# EasyEDA Pro project TRV-Controller.epro, schematic PoESupply_WithPSU

## Sheets
1 PoE isolator: Board Name: TRV-Controller; Create Date: 2024-07-17; Page Name: PoE isolator; Project Name: TRV-Controller; Schematic Name: PoESupply_WithPSU; Update Date: 2025-01-25; Add into BOM: yes; Company: DemoEffect; Convert to PCB: yes; Date: 2024-01-25; Draw By: Peter; REV: 1.1; Sheet: 1/1
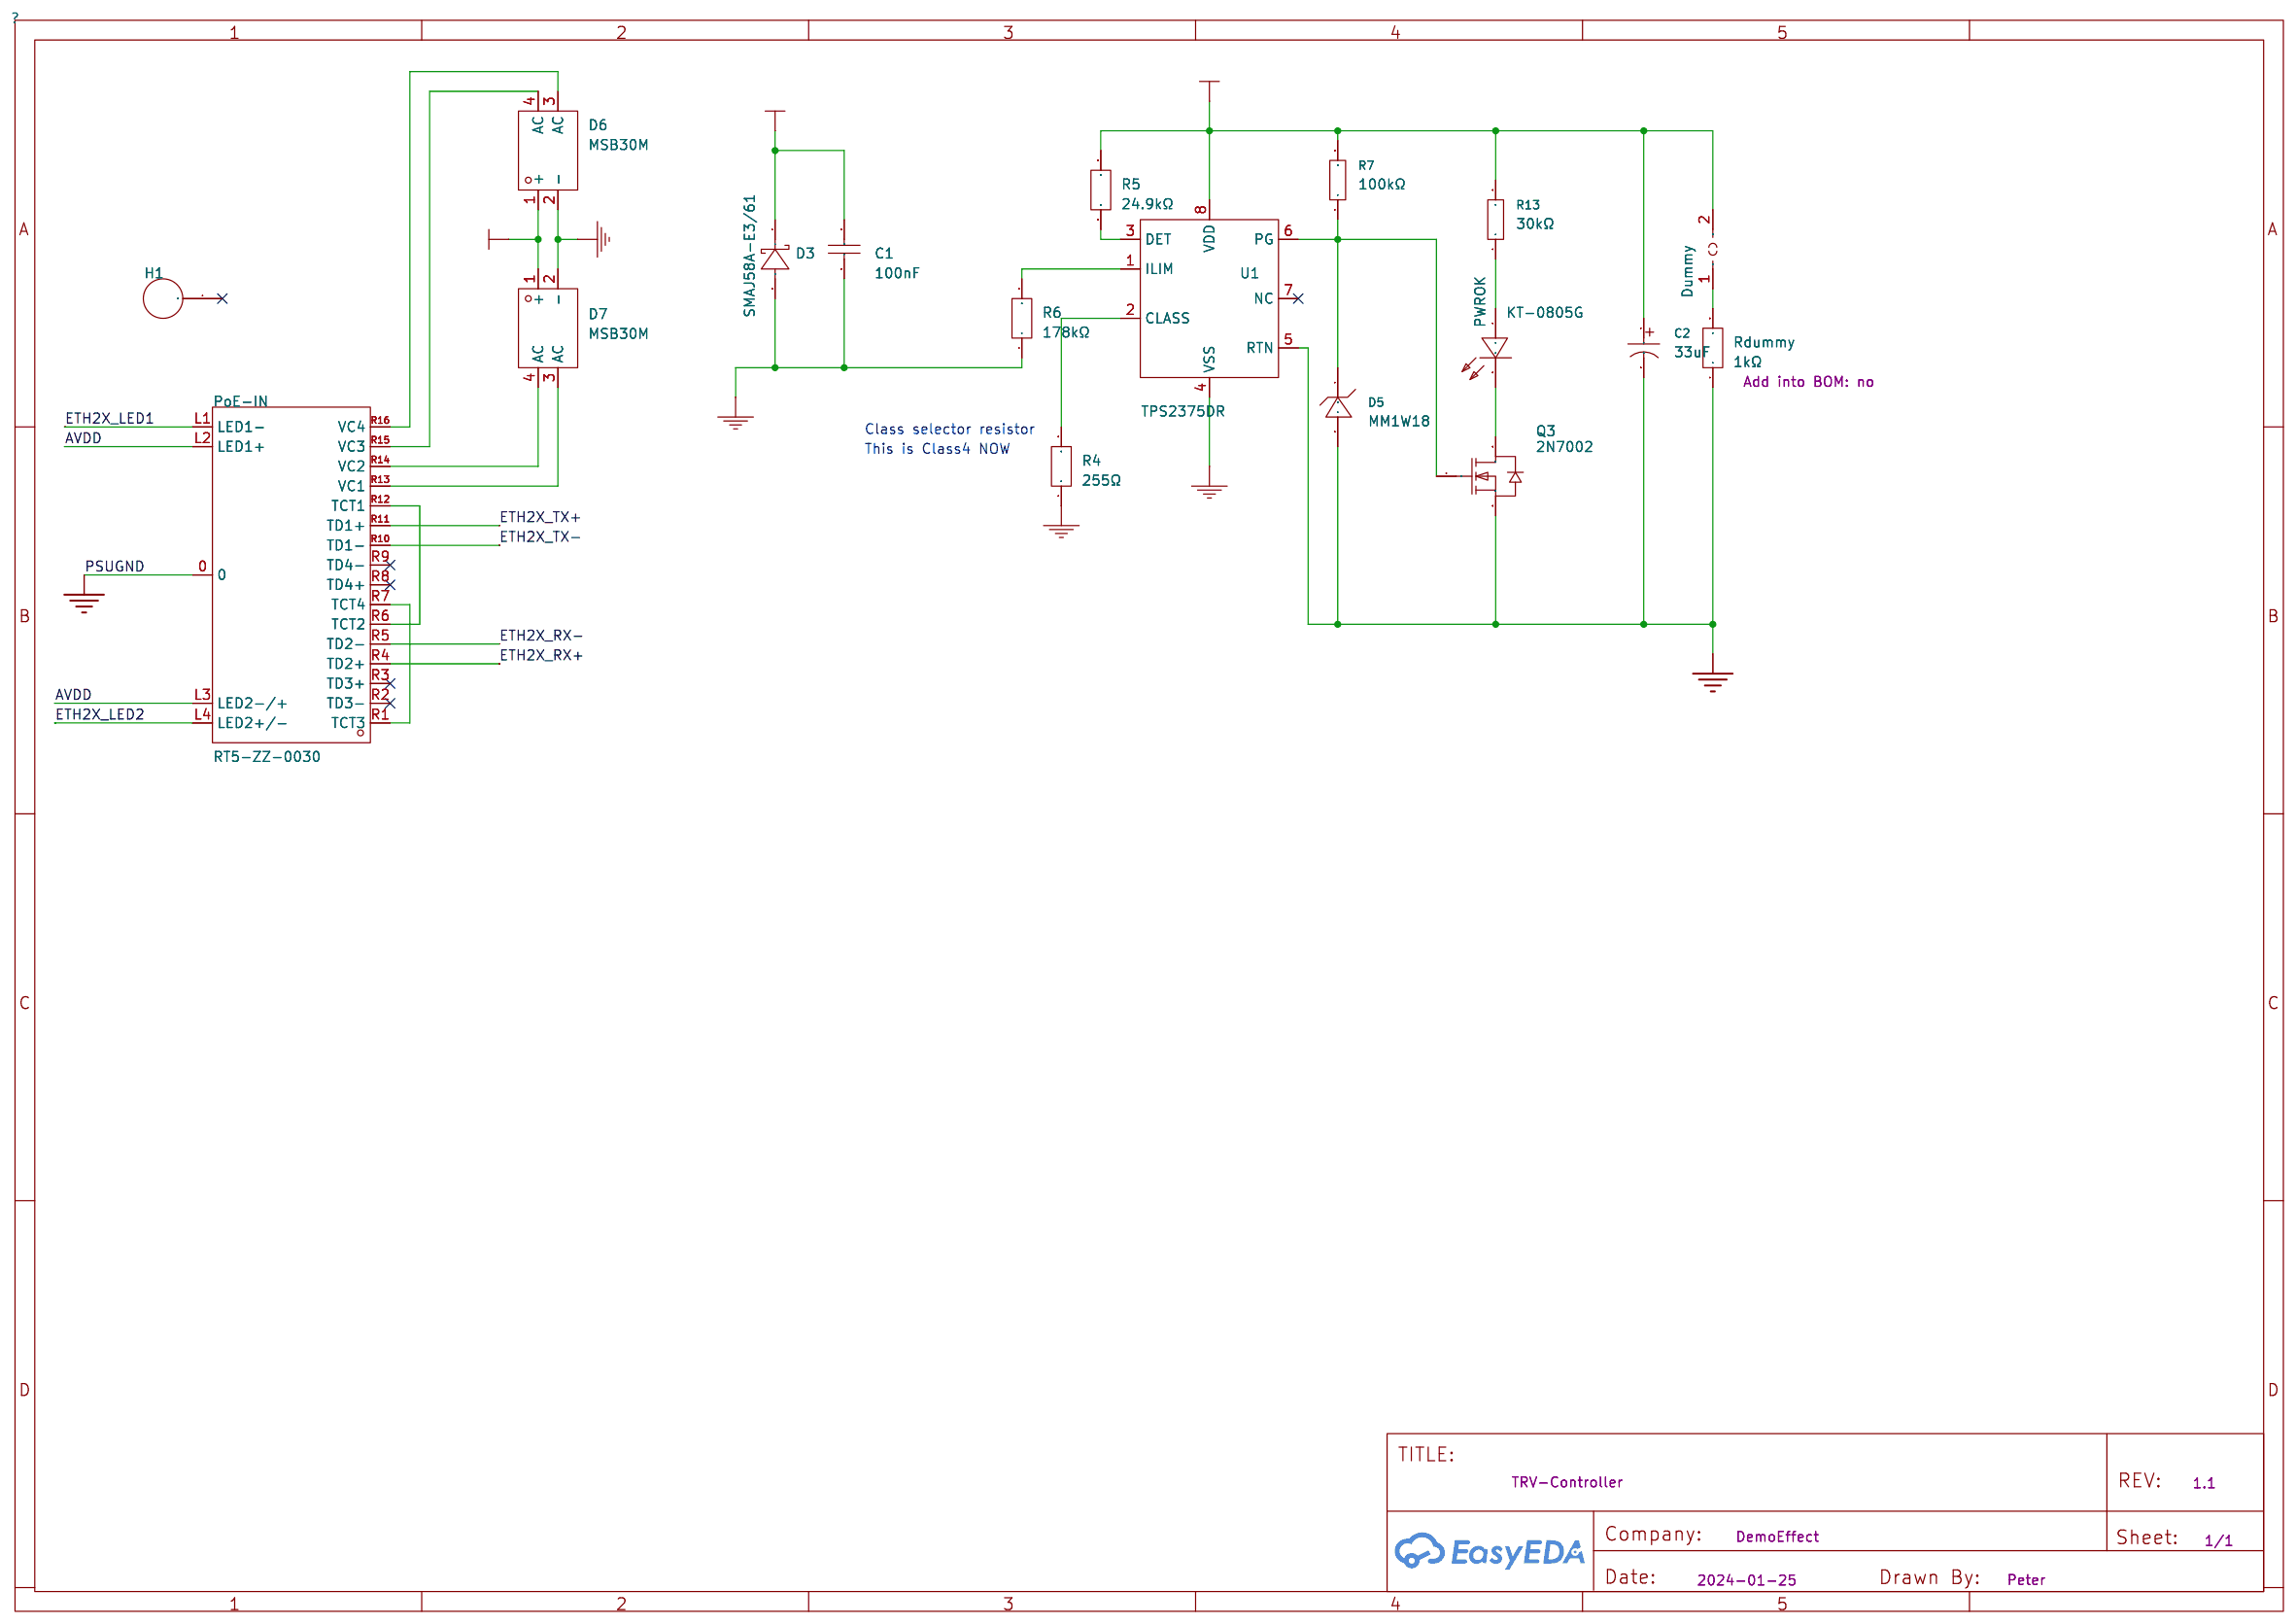
[diagram p0: PoE isolator]
2 Power supplies: Page Name: Power supplies; Update Date: 2024-08-13; Drawn: EasyEDA; Page Size: A4; Version: V1.1
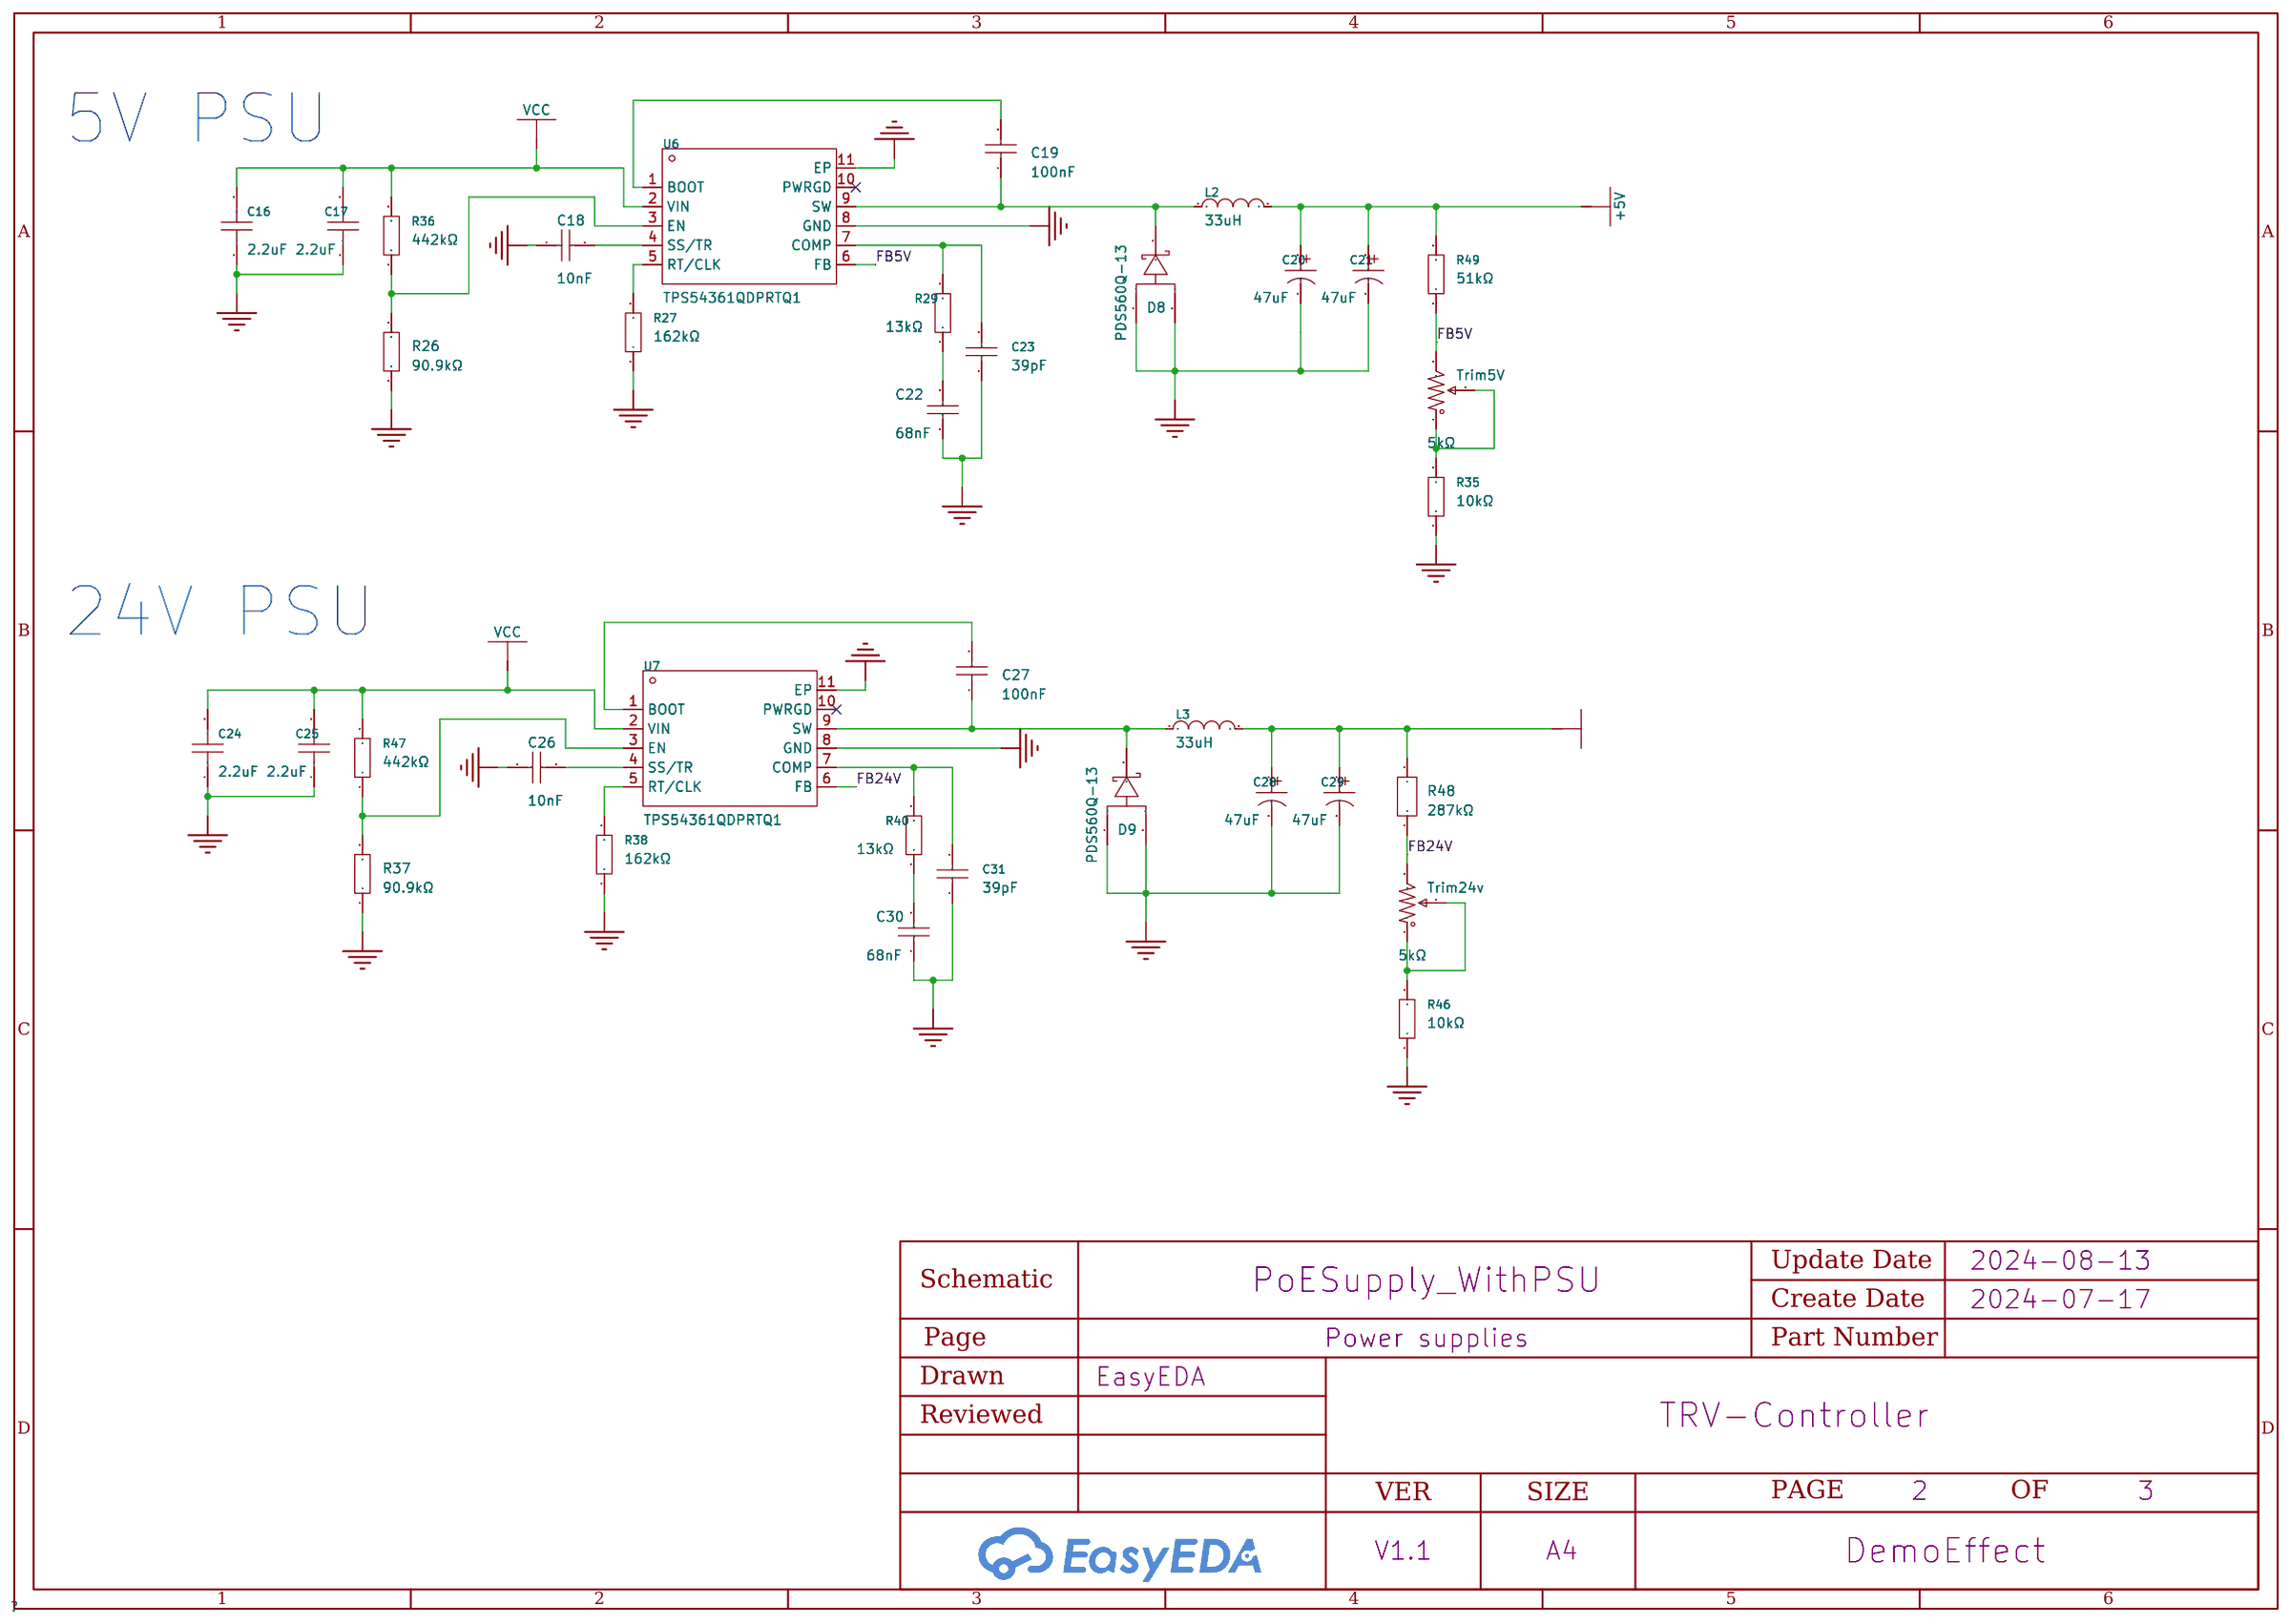
[diagram p1: Power supplies]
3 MCU: Page Name: MCU; Drawn: Peter; Page Size: A4; Version: V1.1
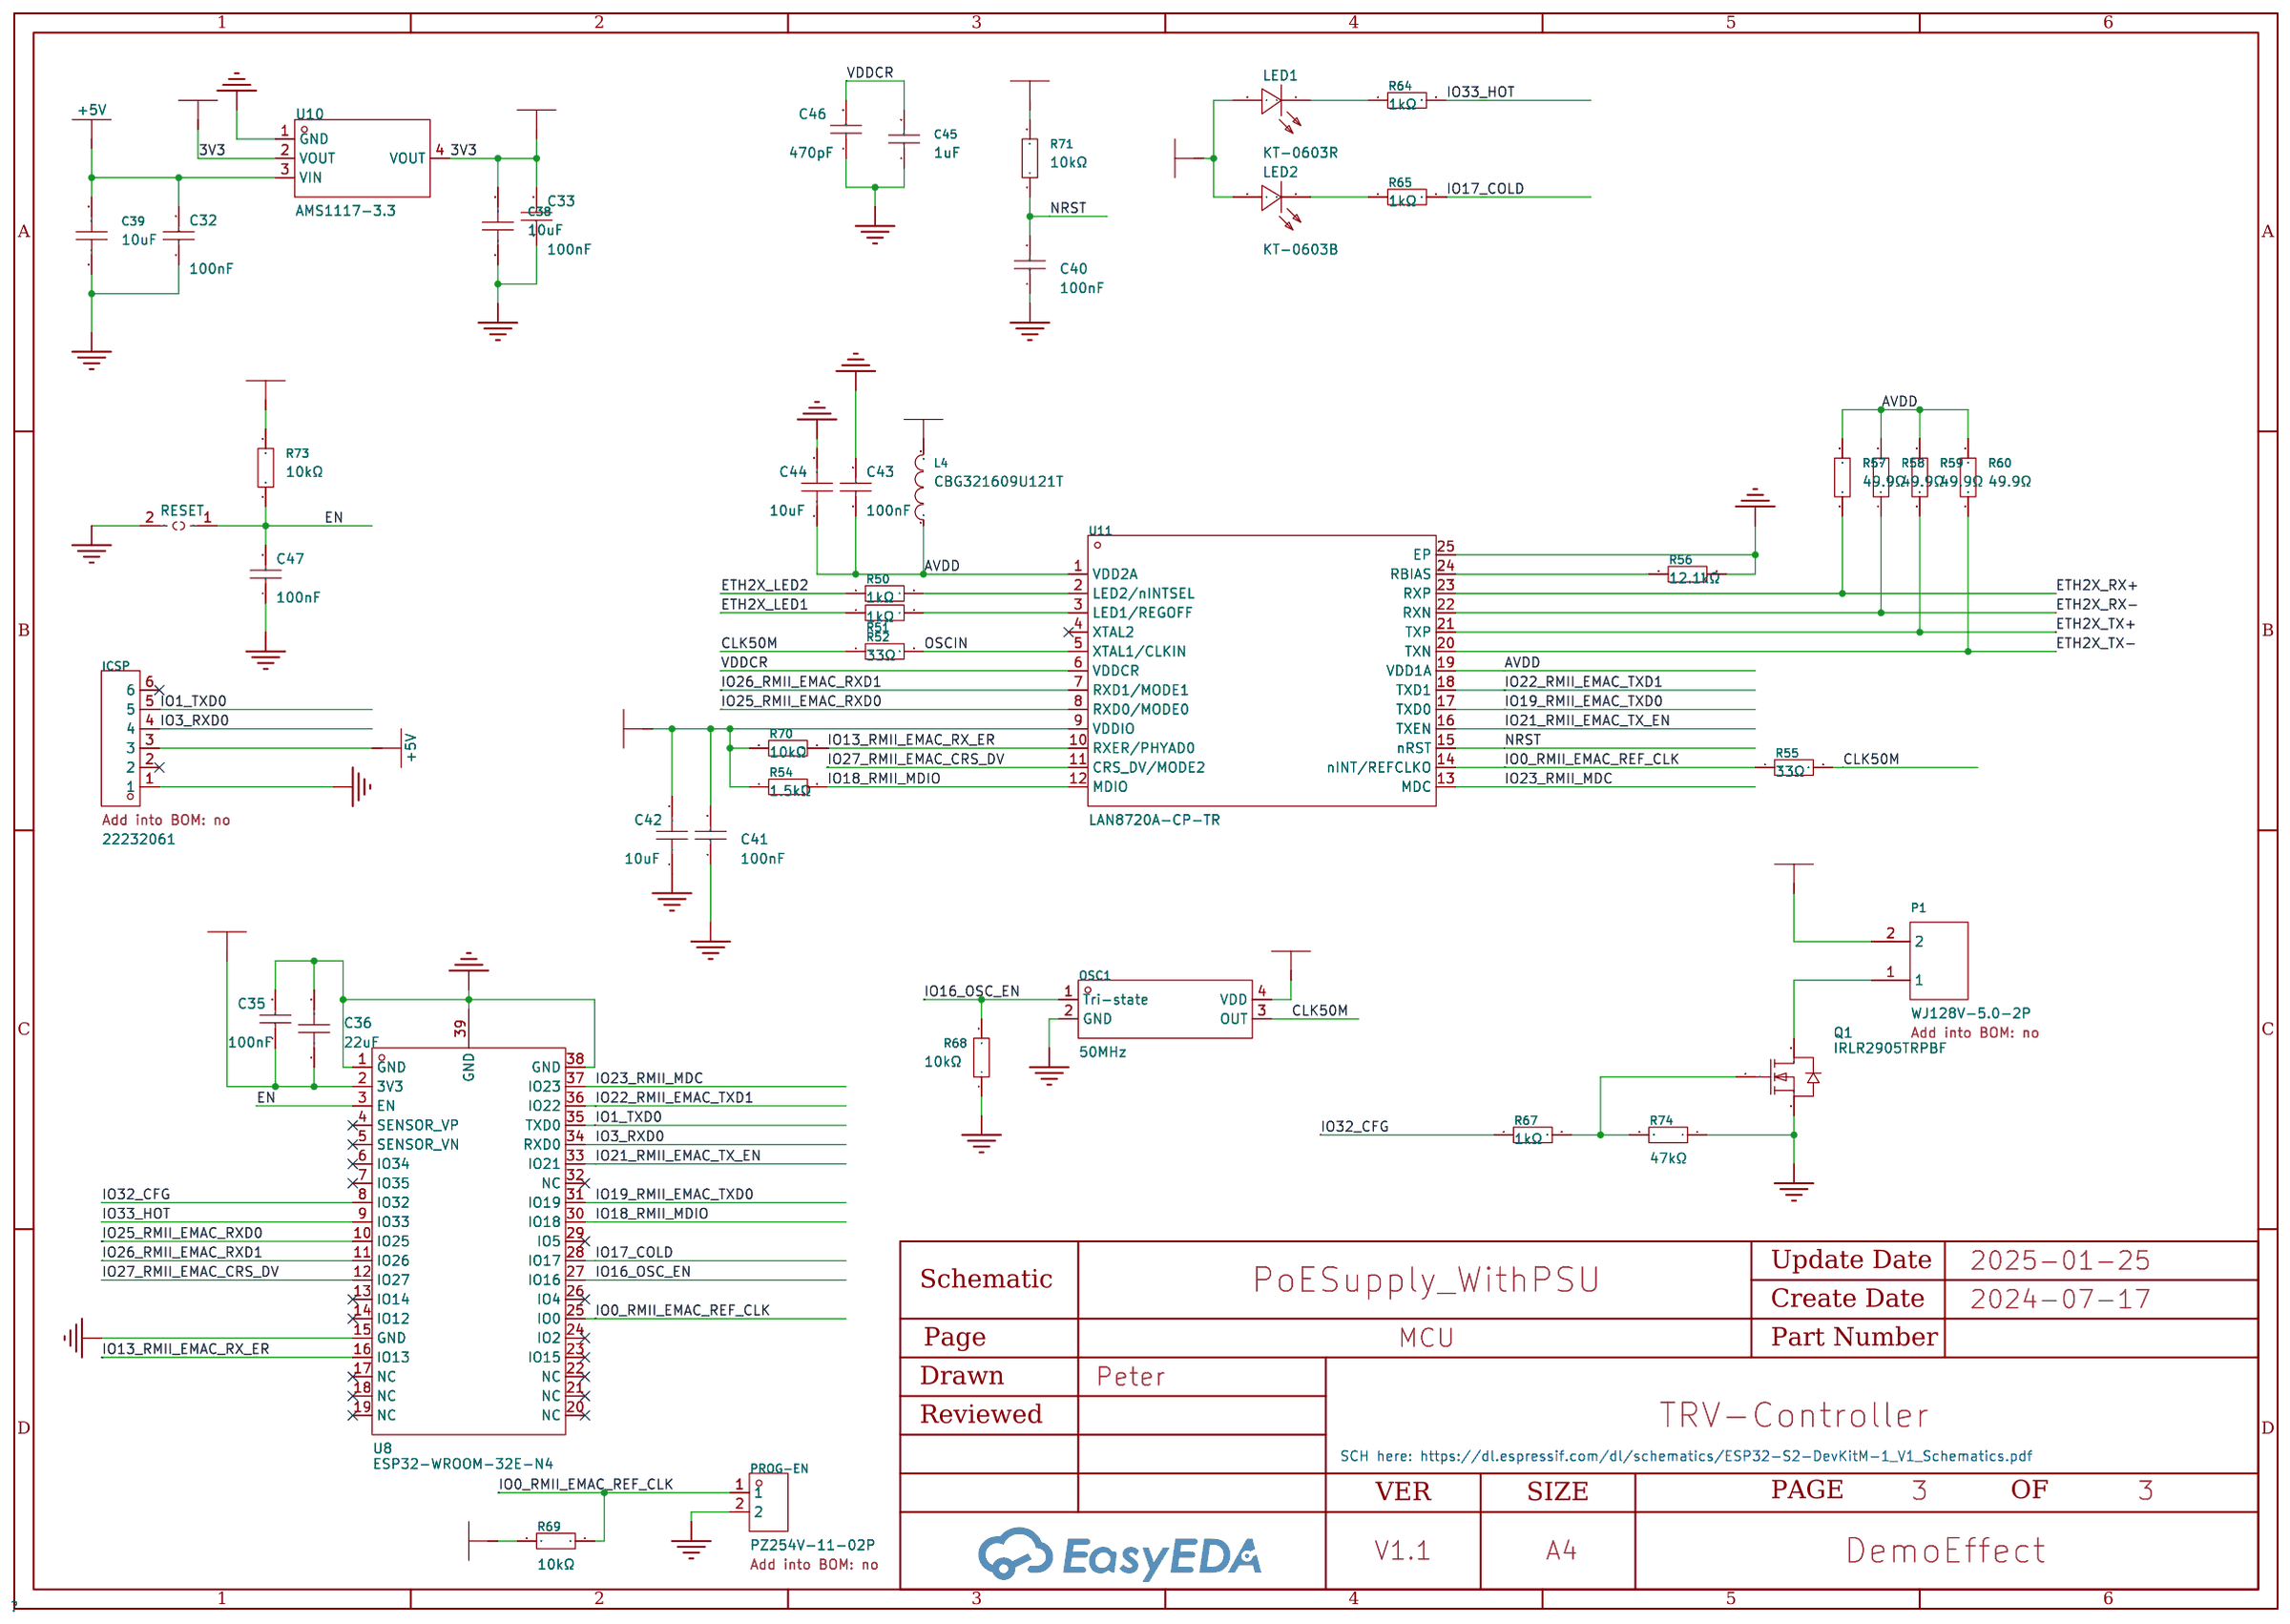
[diagram p2: MCU]

## Parts
sheet MCU
C32  100nF  [C0805]
C33  100nF  [C0805]
C35  100nF  [C0805]
C36  22uF  [C0805]
C38  10uF  [C0603]
C39  10uF  [C0603]
C40  100nF  [C0805]
C41  100nF  [C0805]
C42  10uF  [C0805]
C43  100nF  [C0805]
C44  10uF  [C0805]
C45  1uF  [C0805]
C46  470pF  [C0805]
C47  100nF  [C0805]
ICSP  22232061  [CONN-TH_6P-P2.54_22232061]  (no BOM)
L4  CBG321609U121T  [L1206]
LED1  KT-0603R  [LED0603-RD]
LED2  KT-0603B  [LED0603-RD]
OSC1  50MHz  [OSC-SMD_4P-L3.2-W2.5-BL]
P1  WJ128V-5.0-2P  [CONN-TH_2P-P5.00_WJ128V-5.0-2P]  (no BOM)
PROG-EN  PZ254V-11-02P  [HDR-TH_2P-P2.54-V-M]  (no BOM)
Q1  IRLR2905TRPBF  [TO-252-3_L6.5-W5.8-P4.58-BL]
R50  1kΩ  [R0402]
R51  1kΩ  [R0402]
R52  33Ω  [R0402]
R54  1.5kΩ  [R0402]
R55  33Ω  [R0402]
R56  12.1kΩ  [R0402]
R57  49.9Ω  [R0402]
R58  49.9Ω  [R0402]
R59  49.9Ω  [R0402]
R60  49.9Ω  [R0402]
R64  1kΩ  [R0402]
R65  1kΩ  [R0402]
R67  1kΩ  [R0402]
R68  10kΩ  [R0603]
R69  10kΩ  [R0603]
R70  10kΩ  [R0603]
R71  10kΩ  [R0603]
R73  10kΩ  [R0603]
R74  47kΩ  [R0805]
RESET  -  [SOLDERJUMPER_REFLOW_NOPASTE]
U8  ESP32-WROOM-32E-N4  [WIFI-SMD_ESP32-WROOM-32E]
U10  AMS1117-3.3  [SOT-223-3_L6.5-W3.4-P2.30-LS7.0-BR]
U11  LAN8720A-CP-TR  [QFN-24_L4.0-W4.0-P0.50-BL-EP2.6]
sheet PoE isolator
C1  100nF  [C0805]
C2  33uF  [CAP-SMD_BD10.0-L10.3-W10.3-LS11.3-FD]
D3  SMAJ58A-E3/61  [SMA_L4.3-W2.6-LS5.1-RD]
D5  MM1W18  [SOD-123_L2.7-W1.6-LS3.7-RD]
D6  MSB30M  [DIO-BG-SMD_UMSB]
D7  MSB30M  [DIO-BG-SMD_UMSB]
Dummy  -  [SOLDERJUMPER_REFLOW_NOPASTE]
H1  -  [HOLE_D3M5_D7M0_PAD_PTH]  (no BOM)
PoE-IN  RT5-ZZ-0030  [RJ45-TH_RT5-ZZ-0030]
PWROK  KT-0805G  [LED0805-R-RD]
Q3  2N7002  [SOT-23-3_L2.9-W1.3-P1.90-LS2.4-BR]
R4  255Ω  [R1210]
R5  24.9kΩ  [R1210]
R6  178kΩ  [R1210]
R7  100kΩ  [R1206]
R13  30kΩ  [R0603]
Rdummy  1kΩ  [RES-TH_BD2.3-L6.5-P10.50-D0.5]  (no BOM)
U1  TPS2375DR  [SOIC-8_L4.9-W3.9-P1.27-LS6.0-BL]
sheet Power supplies
C16  2.2uF  [C1210]
C17  2.2uF  [C1210]
C18  10nF  [C0805]
C19  100nF  [C0805]
C20  47uF  [CAP-SMD_BD6.3-L6.6-W6.6-LS7.6-FD]
C21  47uF  [CAP-SMD_BD6.3-L6.6-W6.6-LS7.6-FD]
C22  68nF  [C0603]
C23  39pF  [C0603]
C24  2.2uF  [C1210]
C25  2.2uF  [C1210]
C26  10nF  [C0805]
C27  100nF  [C0805]
C28  47uF  [CAP-SMD_BD6.3-L6.6-W6.6-LS7.6-FD]
C29  47uF  [CAP-SMD_BD6.3-L6.6-W6.6-LS7.6-FD]
C30  68nF  [C0603]
C31  39pF  [C0603]
D8  PDS560Q-13  [POWERDI-5_L5.4-W4.0-LS6.5-RD]
D9  PDS560Q-13  [POWERDI-5_L5.4-W4.0-LS6.5-RD]
L2  33uH  [IND-SMD_L11.5-W10.0_FXL1040]
L3  33uH  [IND-SMD_L11.5-W10.0_FXL1040]
R26  90.9kΩ  [R0402]
R27  162kΩ  [R0603]
R29  13kΩ  [R0603]
R35  10kΩ  [R0603]
R36  442kΩ  [R0402]
R37  90.9kΩ  [R0402]
R38  162kΩ  [R0603]
R40  13kΩ  [R0603]
R46  10kΩ  [R0603]
R47  442kΩ  [R0402]
R48  287kΩ  [R0805]
R49  51kΩ  [R0402]
Trim5V  5kΩ  [RES-ADJ-SMD_3P-L4.5-W4.5-P2.35-BR]
Trim24v  5kΩ  [RES-ADJ-SMD_3P-L4.5-W4.5-P2.35-BR]
U6  TPS54361QDPRTQ1  [WSON-10_L4.0-W4.0-P0.80-TL-EP]
U7  TPS54361QDPRTQ1  [WSON-10_L4.0-W4.0-P0.80-TL-EP]

## Library data of the parts
C1 C19 C27 C32 C33 C35 C40 C41 C43 C47 = CL21B104KCFNNNE: Capacitance: Tolerance:±10% Tolerance:±10% Voltage Rated: Temperature Coefficient:; LCSC Part Name: 100nF ±10% 100V; Supplier Part: C28233; Manufacturer: SAMSUNG(三星); Supplier Footprint: 0805; JLCPCB Part Class: Basic Part; Datasheet: https://atta.szlcsc.com/upload/public/pdf/source/20160218/1457707763339.pdf; Supplier: LCSC; Tolerance: ±10%
C36 = CL21A226MAQNNNE: Capacitance: Tolerance:±20% Tolerance:±20% Voltage Rated: Temperature Coefficient:; LCSC Part Name: 22uF ±20% 25V; Supplier Part: C45783; Manufacturer: SAMSUNG(三星); Supplier Footprint: 0805; JLCPCB Part Class: Basic Part; Datasheet: https://atta.szlcsc.com/upload/public/pdf/source/20160218/1457707763339.pdf; Supplier: LCSC; Tolerance: ±20%
C38 C39 = CL10A106KP8NNNC: Capacitance: Tolerance:±10% Tolerance:±10% Voltage Rated: Temperature Coefficient:; LCSC Part Name: 10uF ±10% 10V; Supplier Part: C19702; Manufacturer: SAMSUNG(三星); Supplier Footprint: 0603; JLCPCB Part Class: Basic Part; Datasheet: https://atta.szlcsc.com/upload/public/pdf/source/20160218/1457707763339.pdf; Supplier: LCSC; Tolerance: ±10%
C42 C44 = CL21A106KAYNNNE_C15850: Capacitance: Tolerance:±10% Tolerance:±10% Voltage Rated: Temperature Coefficient:; LCSC Part Name: 10uF ±10% 25V; Supplier Part: C15850; Manufacturer: SAMSUNG(三星); Manufacturer Part: CL21A106KAYNNNE; Supplier Footprint: 0805; JLCPCB Part Class: Basic Part; Datasheet: https://atta.szlcsc.com/upload/public/pdf/source/20160218/1457707763339.pdf; Supplier: LCSC; Tolerance: ±10%
C45 = CL21B105KBFNNNE: Capacitance: Tolerance:±10% Tolerance:±10% Voltage Rated: Temperature Coefficient:; LCSC Part Name: 1uF ±10% 50V; Supplier Part: C28323; Manufacturer: SAMSUNG(三星); Supplier Footprint: 0805; JLCPCB Part Class: Basic Part; Datasheet: https://atta.szlcsc.com/upload/public/pdf/source/20160218/1457707763339.pdf; Supplier: LCSC; Tolerance: ±10%
C46 = 0805B471K500NT: Capacitance: Tolerance:±10% Tolerance:±10% Voltage Rated: Temperature Coefficient:; LCSC Part Name: 470pF ±10% 50V; Supplier Part: C1743; Manufacturer: FH(风华); Supplier Footprint: 0805; JLCPCB Part Class: Basic Part; Datasheet: https://atta.szlcsc.com/upload/public/pdf/source/20200305/C486355_26A10D38EF8C2A5C37091D0039909270.pdf; Supplier: LCSC; Tolerance: ±10%
ICSP = 22232061: Pins Structure:1x6P Pitch:2.54mm Mounting Style:Straight Reference Series:- Number of Pins:6P Number of Rows:1 Number of PINs Per Row:6 Row Spacing:- Current Rating (Max):- Operating Temperature Range:- Operating Temperature Range:-; LCSC Part Name: 1x6P 间距:2.54mm 直插; Supplier Part: C240820; Manufacturer: MOLEX; Supplier Footprint: 插件,P=2.54mm; JLCPCB Part Class: Extended Part; Datasheet: https://atta.szlcsc.com/upload/public/pdf/source/20200109/C114123_E56320BB7CC6463DA76851D6284C5DE6.pdf; Supplier: LCSC; Pins Structure: 1x6P; Pitch: 2.54mm; Mounting Style: Straight; Number of Pins: 6P; Number of Rows: 1; Number of PINs Per Row: 6
L4 = CBG321609U121T: Impedance @ Frequency:120Ω@100MHz Tolerance:±25% Tolerance:±25% DC Resistance:150mΩ Current Rating:1A Circuits:1; LCSC Part Name: 单路 1206磁珠 阻抗120Ω@100MHz; Supplier Part: C39279; Manufacturer: FH(风华); Supplier Footprint: 1206; JLCPCB Part Class: Extended Part; Datasheet: https://atta.szlcsc.com/upload/public/pdf/source/20190129/C361667_1614D407CC98D1D3CFBD9E1F7511C14D.pdf; Supplier: LCSC; Impedance @ Frequency: 120Ω@100MHz; Tolerance: ±25%; DC Resistance: 150mΩ; Current Rating: 1A; Circuits: 1
LED1 = KT-0603R: Emitted Color:Red Power Dissipation:- Forward Current:- Dominant Wavelength:- Dominant Wavelength:- Peak Wavelength:- Diode Configuration:- Lens Color:- Color Temperature:- Color Temperature:- Viewing Angle:- Mounting Sytle:- Operating Temperature:-40℃~+8; LCSC Part Name: 0603 红灯 高亮; Supplier Part: C2286; Manufacturer: KENTO; Supplier Footprint: 0603; JLCPCB Part Class: Basic Part; Datasheet: https://atta.szlcsc.com/upload/public/pdf/source/20160616/1466072038404.pdf; Supplier: LCSC; Emitted Color: Red; Operating Temperature: -40℃~+85℃
LED2 = KT-0603B: Emitted Color:Blue Power Dissipation:- Forward Current:- Dominant Wavelength:- Dominant Wavelength:- Peak Wavelength:- Diode Configuration:- Lens Color:- Color Temperature:- Color Temperature:- Viewing Angle:- Mounting Sytle:- Operating Temperature:- Oper; LCSC Part Name: 0603 蓝灯 高亮; Supplier Part: C2288; Manufacturer: KENTO; Supplier Footprint: 0603; JLCPCB Part Class: Extended Part; Datasheet: https://atta.szlcsc.com/upload/public/pdf/source/20150713/1457707325118.pdf; Supplier: LCSC; Emitted Color: Blue
OSC1 = OT2EL4C4JI-111OLP-50M: Frequency:50MHz Normal temperature Frequency Tolerance:±10ppm Normal temperature Frequency Tolerance:±10ppm Output Type:CMOS Supply Voltage:1.8V~3.3V Supply Voltage:1.8V~3.3V Operating Temperature:-40℃~+85℃ Operating Temperature:-40℃~+85℃; LCSC Part Name: 50MHZ 1.8V-3.3V ±10PPM YSO110TR; Supplier Part: C5203552; Manufacturer: YXC(扬兴晶振); Supplier Footprint: SMD3225-4P; JLCPCB Part Class: Extended Part; Datasheet: https://atta.szlcsc.com/upload/public/pdf/source/20221021/8EF4F09ADC038A72733019B2AF7514EF.pdf; Supplier: LCSC; Normal temperature Frequency Tolerance: ±10ppm; Output Type: CMOS; Supply Voltage: 1.8V~3.3V; Operating Temperature: -40℃~+85℃
P1 = WJ128V-5.0-2P: Structure:1x2P Pitch:5mm Color:Green Mounting Style:Straight Current Rating (Max):20A Voltage Rating (Max):250V Number of Pins:2P Number of Rows:1 Wire Gauge - AWG:12~22 Wire Gauge - AWG:12~22 Wire Gauge - mm2:2.5 Wire Gauge - mm2:2.5 Number of PINs Per R; LCSC Part Name: 5mm 1x2P 排数:1 每排P数:2 直插; Supplier Part: C8269; Manufacturer: KANGNEX(康奈克斯电气); Supplier Footprint: 插件,P=5mm; JLCPCB Part Class: Extended Part; Datasheet: https://atta.szlcsc.com/upload/public/pdf/source/20191225/C8269_1FF44D6D2E83DB14A7CA266A410FD9AD.pdf; Supplier: LCSC; Structure: 1x2P; Pitch: 5mm; Color: Green; Mounting Style: Straight; Current Rating (Max): 20A; Voltage Rating (Max): 250V; Number of Pins: 2P; Number of Rows: 1; Wire Gauge - AWG: 12~22; Wire Gauge - mm2: 2.5; Number of PINs Per Row: 2; Operating Temperature Range: -40℃~+105℃
PROG-EN = PZ254V-11-02P: Pin Structure:1x2P Pitch:2.54mm Row Spacing:- Circluar Pins/Square Pins:Square Pins Mounting Type:Straight Number of Rows:Plugin Number of Pins:2P Current Rating (Max):- Voltage Rating (Max):- Length of Mating Pin:6mm Insulation Height:2.5mm Length of End; LCSC Part Name: 间距:2.54mm 1x2P 直插 方针; Supplier Part: C492401; Manufacturer: XFCN(兴飞); Supplier Footprint: 插件,P=2.54mm; JLCPCB Part Class: Extended Part; Datasheet: https://atta.szlcsc.com/upload/public/pdf/source/20200309/C492401_A812433581A9B211A7FFA413ADDFF0E5.pdf; Supplier: LCSC; Pin Structure: 1x2P; Pitch: 2.54mm; Circluar Pins/Square Pins: Square Pins; Mounting Type: Straight; Number of Rows: Plugin; Number of Pins: 2P; Length of Mating Pin: 6mm; Insulation Height: 2.5mm; Length of End Connection Pin: 3mm; Operating Temperature Range: -40℃~+105℃; Color: Black
Q1 = IRLR2905TRPBF: Type: Drain Source Voltage (Vdss): Continuous Drain Current (Id): Power Dissipation (Pd): Drain Source On Resistance (RDS(on)@Vgs,Id):27mΩ@10V,25A Gate Threshold Voltage (Vgs(th)@Id):2V@250uA Total Gate Charge (Qg@Vgs):48nC@5V Input Capacitance (Ciss@Vds); LCSC Part Name: N沟道 耐压:55V 电流:42A; Supplier Part: C3010; Manufacturer: Infineon(英飞凌); Supplier Footprint: TO-252-2(DPAK); JLCPCB Part Class: Extended Part; Datasheet: https://atta.szlcsc.com/upload/public/pdf/source/20200525/C538166_EEF86BBE41617DD7FD56D1C9FFE2281C.pdf; Supplier: LCSC; Drain Source On Resistance (RDS(on)@Vgs,Id): 27mΩ@10V,25A; Gate Threshold Voltage (Vgs(th)@Id): 2V@250uA; Total Gate Charge (Qg@Vgs): 48nC@5V; Input Capacitance (Ciss@Vds): 1.7nF@25V; Operating Temperature: -55℃~+175℃@(Tj)
R50 R51 R64 R65 R67 = 0402WGF1001TCE: Type:Thick Film Resistors Resistance:1kΩ Tolerance:±1% Tolerance:±1% Power(Watts): Overload Voltage (Max): Temperature Coefficient:±100ppm/℃ Temperature Coefficient:±100ppm/℃ Operating Temperature Range:-55℃~+155℃ Operating Temperature Range:-55℃~+155℃; LCSC Part Name: 1kΩ ±1% 62.5mW 厚膜电阻; Supplier Part: C11702; Manufacturer: UNI-ROYAL(厚声); Supplier Footprint: 0402; JLCPCB Part Class: Basic Part; Datasheet: https://atta.szlcsc.com/upload/public/pdf/source/20200306/C422600_1E6D84923E4A46A82E41ADD87F860B5C.pdf; Supplier: LCSC; Type: Thick Film Resistors; Tolerance: ±1%; Temperature Coefficient: ±100ppm/℃; Operating Temperature Range: -55℃~+155℃
R52 R55 = 0402WGF330JTCE: Type:Thick Film Resistors Resistance:33Ω Tolerance:±1% Tolerance:±1% Power(Watts): Overload Voltage (Max): Temperature Coefficient:±100ppm/℃ Temperature Coefficient:±100ppm/℃ Operating Temperature Range:-55℃~+155℃ Operating Temperature Range:-55℃~+155℃; LCSC Part Name: 33Ω ±1% 62.5mW 厚膜电阻; Supplier Part: C25105; Manufacturer: UNI-ROYAL(厚声); Supplier Footprint: 0402; JLCPCB Part Class: Basic Part; Datasheet: https://atta.szlcsc.com/upload/public/pdf/source/20200306/C422600_1E6D84923E4A46A82E41ADD87F860B5C.pdf; Supplier: LCSC; Type: Thick Film Resistors; Tolerance: ±1%; Temperature Coefficient: ±100ppm/℃; Operating Temperature Range: -55℃~+155℃
R54 = 0402WGF1501TCE: Type:Thick Film Resistors Resistance:1.5kΩ Tolerance:±1% Tolerance:±1% Power(Watts): Overload Voltage (Max): Temperature Coefficient:±100ppm/℃ Temperature Coefficient:±100ppm/℃ Operating Temperature Range:-55℃~+155℃ Operating Temperature Range:-55℃~+155℃; LCSC Part Name: 1.5kΩ ±1% 62.5mW 厚膜电阻; Supplier Part: C25867; Manufacturer: UNI-ROYAL(厚声); Supplier Footprint: 0402; JLCPCB Part Class: Basic Part; Datasheet: https://atta.szlcsc.com/upload/public/pdf/source/20200306/C422600_1E6D84923E4A46A82E41ADD87F860B5C.pdf; Supplier: LCSC; Type: Thick Film Resistors; Tolerance: ±1%; Temperature Coefficient: ±100ppm/℃; Operating Temperature Range: -55℃~+155℃
R56 = 0402WGF1212TCE: Type:Thick Film Resistors Resistance:12.1kΩ Tolerance:±1% Tolerance:±1% Power(Watts): Overload Voltage (Max): Temperature Coefficient:±100ppm/℃ Temperature Coefficient:±100ppm/℃ Operating Temperature Range:-55℃~+155℃ Operating Temperature Range:-55℃~+155℃; LCSC Part Name: 12.1kΩ ±1% 62.5mW 厚膜电阻; Supplier Part: C25852; Manufacturer: UNI-ROYAL(厚声); Supplier Footprint: 0402; JLCPCB Part Class: Extended Part; Datasheet: https://atta.szlcsc.com/upload/public/pdf/source/20200306/C422600_1E6D84923E4A46A82E41ADD87F860B5C.pdf; Supplier: LCSC; Type: Thick Film Resistors; Tolerance: ±1%; Temperature Coefficient: ±100ppm/℃; Operating Temperature Range: -55℃~+155℃
R57-R60 = 0402WGF499JTCE: Type:Thick Film Resistors Resistance:49.9Ω Tolerance:±1% Tolerance:±1% Power(Watts): Overload Voltage (Max): Temperature Coefficient:±100ppm/℃ Temperature Coefficient:±100ppm/℃ Operating Temperature Range:-55℃~+155℃ Operating Temperature Range:-55℃~+155℃; LCSC Part Name: 49.9Ω ±1% 62.5mW 厚膜电阻; Supplier Part: C25120; Manufacturer: UNI-ROYAL(厚声); Supplier Footprint: 0402; JLCPCB Part Class: Basic Part; Datasheet: https://atta.szlcsc.com/upload/public/pdf/source/20200306/C422600_1E6D84923E4A46A82E41ADD87F860B5C.pdf; Supplier: LCSC; Type: Thick Film Resistors; Tolerance: ±1%; Temperature Coefficient: ±100ppm/℃; Operating Temperature Range: -55℃~+155℃
R35 R46 R68-R71 R73 = 0603WAF1002T5E: Type:Thick Film Resistors Resistance:10kΩ Tolerance:±1% Tolerance:±1% Power(Watts): Overload Voltage (Max): Temperature Coefficient:±100ppm/℃ Temperature Coefficient:±100ppm/℃ Operating Temperature Range:-55℃~+155℃ Operating Temperature Range:-55℃~+155℃; LCSC Part Name: 厚膜电阻 10kΩ ±1% 100mW; Supplier Part: C25804; Manufacturer: UNI-ROYAL(厚声); Supplier Footprint: 0603; JLCPCB Part Class: Basic Part; Datasheet: https://atta.szlcsc.com/upload/public/pdf/source/20200306/C422600_1E6D84923E4A46A82E41ADD87F860B5C.pdf; Supplier: LCSC; Type: Thick Film Resistors; Tolerance: ±1%; Temperature Coefficient: ±100ppm/℃; Operating Temperature Range: -55℃~+155℃
R74 = 0805W8F4702T5E: Type:Thick Film Resistors Resistance:47kΩ Tolerance:±1% Tolerance:±1% Power(Watts): Overload Voltage (Max): Temperature Coefficient:±100ppm/℃ Temperature Coefficient:±100ppm/℃ Operating Temperature Range:-55℃~+155℃ Operating Temperature Range:-55℃~+155℃; LCSC Part Name: 47kΩ ±1% 125mW 厚膜电阻; Supplier Part: C17713; Manufacturer: UNI-ROYAL(厚声); Supplier Footprint: 0805; JLCPCB Part Class: Basic Part; Datasheet: https://atta.szlcsc.com/upload/public/pdf/source/20200306/C422600_1E6D84923E4A46A82E41ADD87F860B5C.pdf; Supplier: LCSC; Type: Thick Film Resistors; Tolerance: ±1%; Temperature Coefficient: ±100ppm/℃; Operating Temperature Range: -55℃~+155℃
Dummy RESET = Solder Jumper
U8 = ESP32-WROOM-32E-N4: LCSC Part Name: 通用型Wi-Fi+BT+BLE MCU模组; Supplier Part: C701341; Manufacturer: ESPRESSIF(乐鑫); Supplier Footprint: SMD,18x25.5mm; JLCPCB Part Class: Extended Part; Datasheet: https://atta.szlcsc.com/upload/public/pdf/source/20220601/0020821B65DE5740BBACA5FACC5CF3B6.pdf; Supplier: LCSC
U10 = AMS1117-3.3_C6186: Output Type: Maximum Input Voltage:- Output Voltage:3.3V Output Voltage:3.3V MAX Output Current:1A Power Supply Rejection Ratio (PSRR):72dB@(120Hz) Dropout Voltage:1.3V@(800mA) standby current:- Noise:- Feature:- Operating Temperature:- Operating Temperat; LCSC Part Name: 输出3.3V 1A; Supplier Part: C6186; Manufacturer: AMS; Supplier Footprint: SOT-223; JLCPCB Part Class: Basic Part; Datasheet: https://atta.szlcsc.com/upload/public/pdf/source/20180727/C6186_7A095716F0823C02F1997A905E26C086.pdf; Supplier: LCSC; Output Voltage: 3.3V; MAX Output Current: 1A; Power Supply Rejection Ratio (PSRR): 72dB@(120Hz); Dropout Voltage: 1.3V@(800mA); Output Polarity: Positive electrode; Number of Outputs: 1
U11 = LAN8720A-CP-TR: Application Function:Transceiver Number of Channels: Interface: Supply Voltage:1.6V~3.6V Supply Voltage:1.6V~3.6V Operating Temperature:0℃~+85℃ Operating Temperature:0℃~+85℃; Supplier Part: C45223; Manufacturer: MICROCHIP(美国微芯); Supplier Footprint: QFN-24-EP(4x4); JLCPCB Part Class: Extended Part; Datasheet: https://atta.szlcsc.com/upload/public/pdf/source/20151012/1457707444106.pdf; Supplier: LCSC; Application Function: Transceiver; Supply Voltage: 1.6V~3.6V; Operating Temperature: 0℃~+85℃
C2 = RVT2A330M1010: Capacitance: Tolerance:±20% Tolerance:±20% Rated Voltage: Ripple Current:- Equivalent Series Resistance(ESR):- φD: L: Lifetime @ Temp:2000hrs@105℃ Operating Temperature:-55℃~+105℃ Operating Temperature:-55℃~+105℃; LCSC Part Name: 33uF ±20% 100V; Supplier Part: C45162; Manufacturer: HONOR(荣誉); JLCPCB Part Class: Extended Part; Datasheet: https://atta.szlcsc.com/upload/public/pdf/source/20210521/C113284_25C86AE95FB541053FE695F13EA8E7D0.pdf; Supplier: LCSC; Tolerance: ±20%; Lifetime @ Temp: 2000hrs@105℃; Operating Temperature: -55℃~+105℃
D3 = SMAJ58A-E3/61: Unidirectional Channels:1 Reverse Stand-Off Voltage (Vrwm):58V Breakdown Voltage:64.4V Peak Pulse Current (Ipp)@10/1000μs:4.3A Maximum Clamping Voltage:93.6V Peak Pulse Power Dissipation (Ppp)@10/1000μs:400W; Supplier Part: C968553; Manufacturer: VISHAY(威世); Supplier Footprint: SMA(DO-214AC); JLCPCB Part Class: Extended Part; Datasheet: https://atta.szlcsc.com/upload/public/pdf/source/20220621/64B55798E36A5B5208ACF330C904532B.pdf; Supplier: LCSC; Unidirectional Channels: 1; Reverse Stand-Off Voltage (Vrwm): 58V; Breakdown Voltage: 64.4V; Peak Pulse Current (Ipp)@10/1000μs: 4.3A; Maximum Clamping Voltage: 93.6V; Peak Pulse Power Dissipation (Ppp)@10/1000μs: 400W
D5 = MM1W18: Diode Configuration:Single Zener Voltage (Nom):18V Reverse Leakage Current (Ir):5uA@13V Zener Voltage (Range):16.8V~19.2V Zener Voltage (Range):16.8V~19.2V Power Dissipation:1W Zener Impedance (Zzt):20Ω Tolerance:±5% Tolerance:±5%; Supplier Part: C382948; Manufacturer: 晶导微电子; Supplier Footprint: SOD-123; JLCPCB Part Class: Extended Part; Datasheet: https://atta.szlcsc.com/upload/public/pdf/source/20191016/C438343_848480885119C50FAC0A14B5219085FE.pdf; Supplier: LCSC; Diode Configuration: Single; Zener Voltage (Nom): 18V; Reverse Leakage Current (Ir): 5uA@13V; Zener Voltage (Range): 16.8V~19.2V; Power Dissipation: 1W; Zener Impedance (Zzt): 20Ω; Tolerance: ±5%
D6 D7 = MSB30M_C173548: Forward Voltage (Vf@If):1.1V@3A Reverse Voltage (Vr): Average Rectified Current (Io): Reverse Leakage Current (Ir):5uA@1kV Peak Forward Surge Current: Operating Temperature:-55℃~+150℃@(Tj) Operating Temperature:-55℃~+150℃@(Tj); LCSC Part Name: 电压:1kV 电流:3A; Supplier Part: C173548; Manufacturer: MDD; Supplier Footprint: UMSB; JLCPCB Part Class: Extended Part; Datasheet: https://atta.szlcsc.com/upload/public/pdf/source/20230823/E8F8E049DAFCDAB0B3259E54EBEBC59F.pdf; Supplier: LCSC; Forward Voltage (Vf@If): 1.1V@3A; Reverse Leakage Current (Ir): 5uA@1kV; Operating Temperature: -55℃~+150℃@(Tj)
H1 = HOLE_D3M5_D7M0_PAD_PTH: 3.5mm diameter plated M3 clearance hole with 7mm diameter pad around it to clear nuts and washers. The symbol has a pin to connect this pad to a net if required. Place a Not Connected &apos;X&apos; on the pin if the hole is to be isolated.
PoE-IN = RT5-ZZ-0030: Connector Type:RJReceptacle USOC Codes:RJ45 Number of Ports:1; LCSC Part Name: RJ45; Supplier Part: C2934914; Manufacturer: UDE(涌德电子); Supplier Footprint: 插件; JLCPCB Part Class: Extended Part; Datasheet: https://atta.szlcsc.com/upload/public/pdf/source/20220615/102D4A6DE2AAF384BA4F568611E5D2D1.pdf; Supplier: LCSC; Connector Type: RJReceptacle; USOC Codes: RJ45; Number of Ports: 1
PWROK = KT-0805G: Emitted Color:Emerald Diode Configuration:- Lamp Holder Type:- Forward Voltage (VF):- Forward Voltage (VF):- Forward Current:- Power Dissipation:- Lens Color:- Dominant Wavelength:- Dominant Wavelength:- Peak Wavelength:- Color Temperature:- Color Tempera; LCSC Part Name: 0805 翠绿 高亮; Supplier Part: C2297; Manufacturer: KENTO; Supplier Footprint: 0805; JLCPCB Part Class: Basic Part; Datasheet: https://atta.szlcsc.com/upload/public/pdf/source/20170209/1486607340485.pdf; Supplier: LCSC; Emitted Color: Emerald
Q3 = 2N7002_C8545: Type: Drain Source Voltage (Vdss): Continuous Drain Current (Id): Power Dissipation (Pd): Drain Source On Resistance (RDS(on)@Vgs,Id):7.5Ω@10V,500mA Gate Threshold Voltage (Vgs(th)@Id):2.5V@250uA; LCSC Part Name: N沟道 耐压:60V 电流:115mA; Supplier Part: C8545; Manufacturer: CJ(江苏长电/长晶); Supplier Footprint: SOT-23; JLCPCB Part Class: Basic Part; Datasheet: https://atta.szlcsc.com/upload/public/pdf/source/20171228/C164913_15144413269051213916.pdf; Supplier: LCSC; Drain Source On Resistance (RDS(on)@Vgs,Id): 7.5Ω@10V,500mA; Gate Threshold Voltage (Vgs(th)@Id): 2.5V@250uA
R4 = AC1210FR-07255RL: Type:Thick Film Resistors Resistance: Tolerance:±1% Tolerance:±1% Power(Watts): Overload Voltage (Max): Temperature Coefficient:±100ppm/℃ Temperature Coefficient:±100ppm/℃ Operating Temperature Range:-55℃~+155℃ Operating Temperature Range:-55℃~+155℃; LCSC Part Name: 厚膜电阻 255Ω ±1% 500mW; Supplier Part: C230137; Manufacturer: YAGEO(国巨); Supplier Footprint: 1210; JLCPCB Part Class: Extended Part; Datasheet: https://atta.szlcsc.com/upload/public/pdf/source/20191108/C230504_7FB43CAE7E86B3B2980C2491161B254C.pdf; Supplier: LCSC; Type: Thick Film Resistors; Tolerance: ±1%; Temperature Coefficient: ±100ppm/℃; Operating Temperature Range: -55℃~+155℃
R5 = AC1210FR-0724K9L: Type:Thick Film Resistors Resistance: Tolerance:±1% Tolerance:±1% Power(Watts): Temperature Coefficient:±100ppm/℃ Temperature Coefficient:±100ppm/℃ Overload Voltage (Max): Operating Temperature Range:-55℃~+155℃ Operating Temperature Range:-55℃~+155℃; LCSC Part Name: 24.9kΩ ±1% 500mW; Supplier Part: C230133; Manufacturer: YAGEO(国巨); Supplier Footprint: 1210; JLCPCB Part Class: Extended Part; Datasheet: https://atta.szlcsc.com/upload/public/pdf/source/20191108/C230133_87C2F8C32D0515BFA452025310B57FF8.pdf; Supplier: LCSC; Type: Thick Film Resistors; Tolerance: ±1%; Temperature Coefficient: ±100ppm/℃; Operating Temperature Range: -55℃~+155℃
R6 = AC1210FR-07178KL: Type:Thick Film Resistors Resistance: Tolerance:±1% Tolerance:±1% Power(Watts): Overload Voltage (Max): Temperature Coefficient:±100ppm/℃ Temperature Coefficient:±100ppm/℃ Operating Temperature Range:-55℃~+155℃ Operating Temperature Range:-55℃~+155℃; LCSC Part Name: 厚膜电阻 178kΩ ±1% 500mW; Supplier Part: C230053; Manufacturer: YAGEO(国巨); Supplier Footprint: 1210; JLCPCB Part Class: Extended Part; Datasheet: https://atta.szlcsc.com/upload/public/pdf/source/20191108/C230504_7FB43CAE7E86B3B2980C2491161B254C.pdf; Supplier: LCSC; Type: Thick Film Resistors; Tolerance: ±1%; Temperature Coefficient: ±100ppm/℃; Operating Temperature Range: -55℃~+155℃
R7 = 1206W4F1003T5E: Type:Thick Film Resistors Resistance:100kΩ Tolerance:±1% Tolerance:±1% Power(Watts): Overload Voltage (Max): Temperature Coefficient:±100ppm/℃ Temperature Coefficient:±100ppm/℃ Operating Temperature Range:-55℃~+155℃ Operating Temperature Range:-55℃~+155℃; LCSC Part Name: 100kΩ ±1% 250mW 厚膜电阻; Supplier Part: C17900; Manufacturer: UNI-ROYAL(厚声); Supplier Footprint: 1206; JLCPCB Part Class: Basic Part; Datasheet: https://atta.szlcsc.com/upload/public/pdf/source/20200306/C422600_1E6D84923E4A46A82E41ADD87F860B5C.pdf; Supplier: LCSC; Type: Thick Film Resistors; Tolerance: ±1%; Temperature Coefficient: ±100ppm/℃; Operating Temperature Range: -55℃~+155℃
R13 = 0603WAF3002T5E: Type:Thick Film Resistors Resistance:30kΩ Tolerance:±1% Tolerance:±1% Power(Watts): Overload Voltage (Max): Temperature Coefficient:±100ppm/℃ Temperature Coefficient:±100ppm/℃ Operating Temperature Range:-55℃~+155℃ Operating Temperature Range:-55℃~+155℃; LCSC Part Name: 30kΩ ±1% 100mW 厚膜电阻; Supplier Part: C22984; Manufacturer: UNI-ROYAL(厚声); Supplier Footprint: 0603; JLCPCB Part Class: Basic Part; Datasheet: https://atta.szlcsc.com/upload/public/pdf/source/20200306/C422600_1E6D84923E4A46A82E41ADD87F860B5C.pdf; Supplier: LCSC; Type: Thick Film Resistors; Tolerance: ±1%; Temperature Coefficient: ±100ppm/℃; Operating Temperature Range: -55℃~+155℃
Rdummy = MF1/4W-1KΩ±1%T52: Type:Metal Film Resistors Resistance: Tolerance:±1% Tolerance:±1% Power(Watts):250mW Temperature Coefficient:±200ppm/℃ Temperature Coefficient:±200ppm/℃; LCSC Part Name: 金属膜电阻 1kΩ ±1% 250mW; Supplier Part: C713997; Manufacturer: 华星机电; Supplier Footprint: 插件,D2.3xL6.5mm; JLCPCB Part Class: Extended Part; Datasheet: https://atta.szlcsc.com/upload/public/pdf/source/20200731/C713882_AE8EB1102749D7E4FB4FB13DC898C429.pdf; Supplier: LCSC; Type: Metal Film Resistors; Tolerance: ±1%; Power(Watts): 250mW; Temperature Coefficient: ±200ppm/℃
U1 = TPS2375DR: Supplier Part: C2867397; Manufacturer: TI(德州仪器); Supplier Footprint: SOIC-8; JLCPCB Part Class: Extended Part; Datasheet: https://atta.szlcsc.com/upload/public/pdf/source/20230222/EFC9DCAB87A87F07CCBB5D968019EFCF.pdf; Supplier: LCSC
C16 C17 C24 C25 = GRM32ER72A225KA35L: Capacitance: Tolerance:±10% Tolerance:±10% Voltage Rated: Temperature Coefficient:; LCSC Part Name: 2.2uF ±10% 100V; Supplier Part: C86054; Manufacturer: muRata(村田); Supplier Footprint: 1210; JLCPCB Part Class: Extended Part; Datasheet: https://atta.szlcsc.com/upload/public/pdf/source/20200305/C490387_23319AE8C154DEB24C505E6C82A8106A.pdf; Supplier: LCSC; Tolerance: ±10%
C18 C26 = CL21B103KBANNNC: Capacitance: Tolerance:±10% Tolerance:±10% Voltage Rated: Temperature Coefficient:; LCSC Part Name: 10nF ±10% 50V; Supplier Part: C1710; Manufacturer: SAMSUNG(三星); Supplier Footprint: 0805; JLCPCB Part Class: Basic Part; Datasheet: https://atta.szlcsc.com/upload/public/pdf/source/20160218/1457707763339.pdf; Supplier: LCSC; Tolerance: ±10%
C20 C21 C28 C29 = RVT1H470M0607_C72523: Capacitance: Tolerance:±20% Tolerance:±20% Rated Voltage: Ripple Current:66mA@120Hz Equivalent Series Resistance(ESR):- φD: L: Lifetime @ Temp:2000hrs@105℃ Operating Temperature:-40℃~+105℃ Operating Temperature:-40℃~+105℃; LCSC Part Name: 47uF ±20% 50V; Supplier Part: C72523; Manufacturer: ROQANG(容强); Manufacturer Part: RVT1H470M0607; Supplier Footprint: SMD,D6.3xL7.7mm; JLCPCB Part Class: Extended Part; Datasheet: https://atta.szlcsc.com/upload/public/pdf/source/20170325/1490427950282.pdf; Supplier: LCSC; Tolerance: ±20%; Ripple Current: 66mA@120Hz; Lifetime @ Temp: 2000hrs@105℃; Operating Temperature: -40℃~+105℃
C22 C30 = CL10B683KB8NNNC: Capacitance: Tolerance:±10% Tolerance:±10% Voltage Rated: Temperature Coefficient:; LCSC Part Name: 68nF ±10% 50V; Supplier Part: C31658; Manufacturer: SAMSUNG(三星); Supplier Footprint: 0603; JLCPCB Part Class: Extended Part; Datasheet: https://atta.szlcsc.com/upload/public/pdf/source/20160218/1457707763339.pdf; Supplier: LCSC; Tolerance: ±10%
C23 C31 = CC0603JRNPO9BN390: Capacitance: Tolerance:±5% Tolerance:±5% Voltage Rated: Temperature Coefficient:; LCSC Part Name: 39pF ±5% 50V; Supplier Part: C107049; Manufacturer: YAGEO(国巨); Supplier Footprint: 0603; JLCPCB Part Class: Extended Part; Datasheet: https://atta.szlcsc.com/upload/public/pdf/source/20170914/C128857_1505359892143968080.pdf; Supplier: LCSC; Tolerance: ±5%
D8 D9 = PDS560Q-13: Diode Configuration:Single Forward Voltage (Vf@If):710mV@8A Reverse Voltage (Vr):60V Average Rectified Current (Io):5A Reverse Leakage Current (Ir):4uA@60V; LCSC Part Name: 电压:60V 电流:5A; Supplier Part: C526696; Manufacturer: DIODES(美台); Supplier Footprint: Power-DI-5; JLCPCB Part Class: Extended Part; Datasheet: https://atta.szlcsc.com/upload/public/pdf/source/20200515/C526696_34F5E8728E9661FDC87044BE667B5D4A.pdf; Supplier: LCSC; Diode Configuration: Single; Forward Voltage (Vf@If): 710mV@8A; Reverse Voltage (Vr): 60V; Average Rectified Current (Io): 5A; Reverse Leakage Current (Ir): 4uA@60V
L2 L3 = FXL1040-330-M: Inductance: Tolerance:±20% Tolerance:±20% Rated Current: Saturation Current (Isat):5A DC Resistance (DCR): Type:一体成型电感; LCSC Part Name: 33uH ±20% 5A; Supplier Part: C475918; Manufacturer: cjiang(长江微电); Supplier Footprint: SMD,11.5x10mm; JLCPCB Part Class: Extended Part; Datasheet: https://atta.szlcsc.com/upload/public/pdf/source/20230516/54757DC4DB76FADFA619F78143C06647.pdf; Supplier: LCSC; Tolerance: ±20%; Saturation Current (Isat): 5A; Type: 一体成型电感
R26 R37 = RC0402FR-0790K9L: Type:Thick Film Resistors Resistance: Tolerance:±1% Tolerance:±1% Power(Watts): Overload Voltage (Max): Temperature Coefficient:±100ppm/℃ Temperature Coefficient:±100ppm/℃ Operating Temperature Range:-55℃~+155℃ Operating Temperature Range:-55℃~+155℃; LCSC Part Name: 厚膜电阻 90.9kΩ ±1% 62.5mW; Supplier Part: C163452; Manufacturer: YAGEO(国巨); Supplier Footprint: 0402; JLCPCB Part Class: Extended Part; Datasheet: https://atta.szlcsc.com/upload/public/pdf/source/20181009/C309620_DA5935B6E1D48212CB7A533FE518B3C2.pdf; Supplier: LCSC; Type: Thick Film Resistors; Tolerance: ±1%; Temperature Coefficient: ±100ppm/℃; Operating Temperature Range: -55℃~+155℃
R27 R38 = 0603WAF1623T5E: Type:Thick Film Resistors Resistance:162kΩ Tolerance:±1% Tolerance:±1% Power(Watts): Overload Voltage (Max): Temperature Coefficient:±100ppm/℃ Temperature Coefficient:±100ppm/℃ Operating Temperature Range:-55℃~+155℃ Operating Temperature Range:-55℃~+155℃; LCSC Part Name: 162kΩ ±1% 100mW 厚膜电阻; Supplier Part: C22815; Manufacturer: UNI-ROYAL(厚声); Supplier Footprint: 0603; JLCPCB Part Class: Extended Part; Datasheet: https://atta.szlcsc.com/upload/public/pdf/source/20200306/C422600_1E6D84923E4A46A82E41ADD87F860B5C.pdf; Supplier: LCSC; Type: Thick Film Resistors; Tolerance: ±1%; Temperature Coefficient: ±100ppm/℃; Operating Temperature Range: -55℃~+155℃
R29 R40 = 0603WAF1302T5E: Type:Thick Film Resistors Resistance:13kΩ Tolerance:±1% Tolerance:±1% Power(Watts): Overload Voltage (Max): Temperature Coefficient:±100ppm/℃ Temperature Coefficient:±100ppm/℃ Operating Temperature Range:-55℃~+155℃ Operating Temperature Range:-55℃~+155℃; LCSC Part Name: 13kΩ ±1% 100mW 厚膜电阻; Supplier Part: C22797; Manufacturer: UNI-ROYAL(厚声); Supplier Footprint: 0603; JLCPCB Part Class: Basic Part; Datasheet: https://atta.szlcsc.com/upload/public/pdf/source/20200306/C422600_1E6D84923E4A46A82E41ADD87F860B5C.pdf; Supplier: LCSC; Type: Thick Film Resistors; Tolerance: ±1%; Temperature Coefficient: ±100ppm/℃; Operating Temperature Range: -55℃~+155℃
R36 R47 = 0402WGF4423TCE: Type:Thick Film Resistors Resistance:442kΩ Tolerance:±1% Tolerance:±1% Power(Watts): Overload Voltage (Max): Temperature Coefficient:±100ppm/℃ Temperature Coefficient:±100ppm/℃ Operating Temperature Range:-55℃~+155℃ Operating Temperature Range:-55℃~+155℃; LCSC Part Name: 442kΩ ±1% 62.5mW 厚膜电阻; Supplier Part: C5101; Manufacturer: UNI-ROYAL(厚声); Supplier Footprint: 0402; JLCPCB Part Class: Extended Part; Datasheet: https://atta.szlcsc.com/upload/public/pdf/source/20200306/C422600_1E6D84923E4A46A82E41ADD87F860B5C.pdf; Supplier: LCSC; Type: Thick Film Resistors; Tolerance: ±1%; Temperature Coefficient: ±100ppm/℃; Operating Temperature Range: -55℃~+155℃
R48 = FRC0805F2873TS: Type:Thick Film Resistors Resistance:287kΩ Tolerance:±1% Tolerance:±1% Power(Watts): Overload Voltage (Max): Temperature Coefficient:±100ppm/℃ Temperature Coefficient:±100ppm/℃ Operating Temperature Range:-55℃~+155℃ Operating Temperature Range:-55℃~+155℃; LCSC Part Name: 287kΩ ±1% 125mW 厚膜电阻; Supplier Part: C2933396; Manufacturer: FOJAN(富捷); Supplier Footprint: 0805; JLCPCB Part Class: Extended Part; Datasheet: https://atta.szlcsc.com/upload/public/pdf/source/20211221/925EC7D7225764EE0046F22065062C87.pdf; Supplier: LCSC; Type: Thick Film Resistors; Tolerance: ±1%; Temperature Coefficient: ±100ppm/℃; Operating Temperature Range: -55℃~+155℃
R49 = 0402WGF5102TCE: Type:Thick Film Resistors Resistance:51kΩ Tolerance:±1% Tolerance:±1% Power(Watts): Overload Voltage (Max): Temperature Coefficient:±100ppm/℃ Temperature Coefficient:±100ppm/℃ Operating Temperature Range:-55℃~+155℃ Operating Temperature Range:-55℃~+155℃; LCSC Part Name: 51kΩ ±1% 62.5mW 厚膜电阻; Supplier Part: C25794; Manufacturer: UNI-ROYAL(厚声); Supplier Footprint: 0402; JLCPCB Part Class: Basic Part; Datasheet: https://atta.szlcsc.com/upload/public/pdf/source/20200306/C422600_1E6D84923E4A46A82E41ADD87F860B5C.pdf; Supplier: LCSC; Type: Thick Film Resistors; Tolerance: ±1%; Temperature Coefficient: ±100ppm/℃; Operating Temperature Range: -55℃~+155℃
Trim5V Trim24v = 3314G-1-502E: Resistance: Tolerance:±20% Tolerance:±20% Rated Voltage:- Power(Watts):250mW Temperature Coefficient:±100ppm/℃ Temperature Coefficient:±100ppm/℃ Turns:; LCSC Part Name: 5kΩ ±20%; Supplier Part: C719180; Manufacturer: BOURNS; Supplier Footprint: SMD-3P,4.5x4.5mm; JLCPCB Part Class: Extended Part; Datasheet: https://atta.szlcsc.com/upload/public/pdf/source/20200907/C711704_9E01BBE91A77C04D4BA3112A60EB8AD1.pdf; Supplier: LCSC; Tolerance: ±20%; Power(Watts): 250mW; Temperature Coefficient: ±100ppm/℃
U6 U7 = TPS54361QDPRTQ1: Function:Step-down type Output Type:Adjustable Input Voltage:4.5V~60V Input Voltage:4.5V~60V Output Voltage:800mV~58.8V Output Voltage:800mV~58.8V Output Current (Max):3.5A Switching Frequency:2.5MHz Operating Temperature:-40℃~+150℃@(TJ) Operating Tempera; Supplier Part: C2070643; Manufacturer: TI(德州仪器); Supplier Footprint: WSON-10-EP(4x4); JLCPCB Part Class: Extended Part; Datasheet: https://www.ti.com/cn/lit/gpn/tps54361-q1; Supplier: LCSC; Function: Step-down type; Output Type: Adjustable; Input Voltage: 4.5V~60V; Output Voltage: 800mV~58.8V; Output Current (Max): 3.5A; Switching Frequency: 2.5MHz; Operating Temperature: -40℃~+150℃@(TJ); Synchronous Rectification: NO; Number of Outputs: 1; Topology: Step-down; Switch tube (built-in/external): 内置

## Nets
3V3: C33.2 C35.1 C36.1 C38.2 C41.2 C42.2 L4.2 LED1.2(A) LED2.2(A) OSC1.4(VDD) R54.1 R69.2 R70.2 R71.2 R73.1 U8.2(3V3) U10.2(VOUT) U10.4(VOUT) U11.9(VDDIO)
+5V: C20.1 C21.1 C32.2 C39.2 ICSP.3 L2.2 R49.2 U10.3(VIN)
+24V: C28.1 C29.1 L3.2 P1.2 R48.2
AVDD: C43.1 C44.1 L4.1 PoE-IN.L2(LED1+) PoE-IN.L3(LED2-/+) R57.2 R58.2 R59.2 R60.2 U11.1(VDD2A) U11.19(VDD1A)
GND: C1.1 D3.2(A) D6.2(-) D7.2(-) R4.1 R6.1 U1.4(VSS)
VCC: C1.2 C2.1 C16.2 C17.2 C24.2 C25.2 D3.1(K) D6.1(+) D7.1(+) Dummy.2 R5.2 R7.2 R13.2 R36.2 R47.2 U1.8(VDD) U6.2(VIN) U7.2(VIN)
VDDCR: C45.2 C46.2 U11.6(VDDCR)
CLK50M: OSC1.3(OUT) R52.1 R55.2
EN: C47.2 R73.2 RESET.1 U8.3(EN)
ETH2X_LED1: PoE-IN.L1(LED1-) R51.1
ETH2X_LED2: PoE-IN.L4(LED2+/-) R50.1
ETH2X_RX+: PoE-IN.R4(TD2+) R57.1 U11.23(RXP)
ETH2X_RX-: PoE-IN.R5(TD2-) R58.1 U11.22(RXN)
ETH2X_TX+: PoE-IN.R11(TD1+) R59.1 U11.21(TXP)
ETH2X_TX-: PoE-IN.R10(TD1-) R60.1 U11.20(TXN)
FB5V: R49.1 Trim5V.3 U6.6(FB)
FB24V: R48.1 Trim24v.3 U7.6(FB)
IO0_RMII_EMAC_REF_CLK: PROG-EN.1 R55.1 R69.1 U8.25(IO0) U11.14(nINT/REFCLKO)
IO1_TXD0: ICSP.5 U8.35(TXD0)
IO3_RXD0: ICSP.4 U8.34(RXD0)
IO13_RMII_EMAC_RX_ER: R70.1 U8.16(IO13) U11.10(RXER/PHYAD0)
IO16_OSC_EN: OSC1.1(Tri-state) R68.2 U8.27(IO16)
IO17_COLD: R65.2 U8.28(IO17)
IO18_RMII_MDIO: R54.2 U8.30(IO18) U11.12(MDIO)
IO19_RMII_EMAC_TXD0: U8.31(IO19) U11.17(TXD0)
IO21_RMII_EMAC_TX_EN: U8.33(IO21) U11.16(TXEN)
IO22_RMII_EMAC_TXD1: U8.36(IO22) U11.18(TXD1)
IO23_RMII_MDC: U8.37(IO23) U11.13(MDC)
IO25_RMII_EMAC_RXD0: U8.10(IO25) U11.8(RXD0/MODE0)
IO26_RMII_EMAC_RXD1: U8.11(IO26) U11.7(RXD1/MODE1)
IO27_RMII_EMAC_CRS_DV: U8.12(IO27) U11.11(CRS_DV/MODE2)
IO32_CFG: R67.1 U8.8(IO32)
IO33_HOT: R64.2 U8.9(IO33)
NRST: C40.2 R71.1 U11.15(nRST)
OSCIN: R52.2 U11.5(XTAL1/CLKIN)
PSUGND: C2.2 C16.1 C17.1 C18.1 C20.2 C21.2 C22.1 C23.1 C24.1 C25.1 C26.1 C28.2 C29.2 C30.1 C31.1 C32.1 C33.1 C35.2 C36.2 C38.1 C39.1 C40.1 C41.1 C42.1 C43.2 C44.2 C45.1 C46.1 C47.1 D5.2(A) D8.1 D8.2 D9.1 D9.2 ICSP.1 OSC1.2(GND) PoE-IN.0 PROG-EN.2 Q1.3(S) Q3.2(S) R26.1 R27.1 R35.1 R37.1 R38.1 R46.1 R56.2 R68.1 R74.1 Rdummy.1 RESET.2 U1.5(RTN) U6.8(GND) U6.11(EP) U7.8(GND) U7.11(EP) U8.1(GND) U8.15(GND) U8.38(GND) U8.39(GND) U10.1(GND) U11.25(EP)
$1N36: R6.2 U1.1(ILIM)
$1N37: R5.1 U1.3(DET)
$1N44: Dummy.1 Rdummy.2
$1N45: PWROK.1(A) R13.1
$1N46: PWROK.2(K) Q3.3(D)
$1N14640: PoE-IN.R1(TCT3) PoE-IN.R7(TCT4)
$1N14694: PoE-IN.R6(TCT2) PoE-IN.R12(TCT1)
$1N15545: D6.4(AC) PoE-IN.R15(VC3)
$1N16790: D6.3(AC) PoE-IN.R16(VC4)
$1N16797: D7.3(AC) PoE-IN.R13(VC1)
$1N16804: D7.4(AC) PoE-IN.R14(VC2)
$1N21745: D5.1(C) Q3.1(G) R7.1 U1.6(PG)
$1N28176: R4.2 U1.2(CLASS)
$2N1122: C18.2 U6.4(SS/TR)
$2N1124: C23.2 R29.2 U6.7(COMP)
$2N1126: C22.2 R29.1
$2N1129: C19.2 U6.1(BOOT)
$2N1134: R26.2 R36.1 U6.3(EN)
$2N1135: R27.2 U6.5(RT/CLK)
$2N1138: C19.1 D8.3 L2.1 U6.9(SW)
$2N1149: R35.2 Trim5V.1 Trim5V.2
$2N2248: C26.2 U7.4(SS/TR)
$2N2250: C31.2 R40.2 U7.7(COMP)
$2N2252: C30.2 R40.1
$2N2255: C27.2 U7.1(BOOT)
$2N2260: R37.2 R47.1 U7.3(EN)
$2N2261: R38.2 U7.5(RT/CLK)
$2N2264: C27.1 D9.3 L3.1 U7.9(SW)
$2N2275: R46.2 Trim24v.1 Trim24v.2
$3N1808: R50.2 U11.2(LED2/nINTSEL)
$3N1811: R51.2 U11.3(LED1/REGOFF)
$3N1874: R56.1 U11.24(RBIAS)
$3N4256: LED1.1(K) R64.1
$3N4295: LED2.1(K) R65.1
$3N6030: P1.1 Q1.2(D)
$3N10808: Q1.1(G) R67.2 R74.2

Not connected (* = marked no-connect by the designer): H1 1*; ICSP 2* 6*; PoE-IN R2(TD3-)* R3(TD3+)* R8(TD4+)* R9(TD4-)*; U1 7(NC)*; U6 10(PWRGD)*; U7 10(PWRGD)*; U8 4(SENSOR_VP)* 5(SENSOR_VN)* 6(IO34)* 7(IO35)* 13(IO14)* 14(IO12)* 17(NC)* 18(NC)* 19(NC)* 20(NC)* 21(NC)* 22(NC)* 23(IO15)* 24(IO2)* 26(IO4)* 29(IO5)* 32(NC)*; U11 4(XTAL2)*

## Notes on the sheets
sheet 1
- Class selector resistor
- This is Class4 NOW
sheet 2
- 5V PSU
- 24V PSU
sheet 3
- SCH here: https://dl.espressif.com/dl/schematics/ESP32-S2-DevKitM-1_V1_Schematics.pdf
